# Altium project Prj_Smart_Door_Quach_Trung_An.PrjPcb
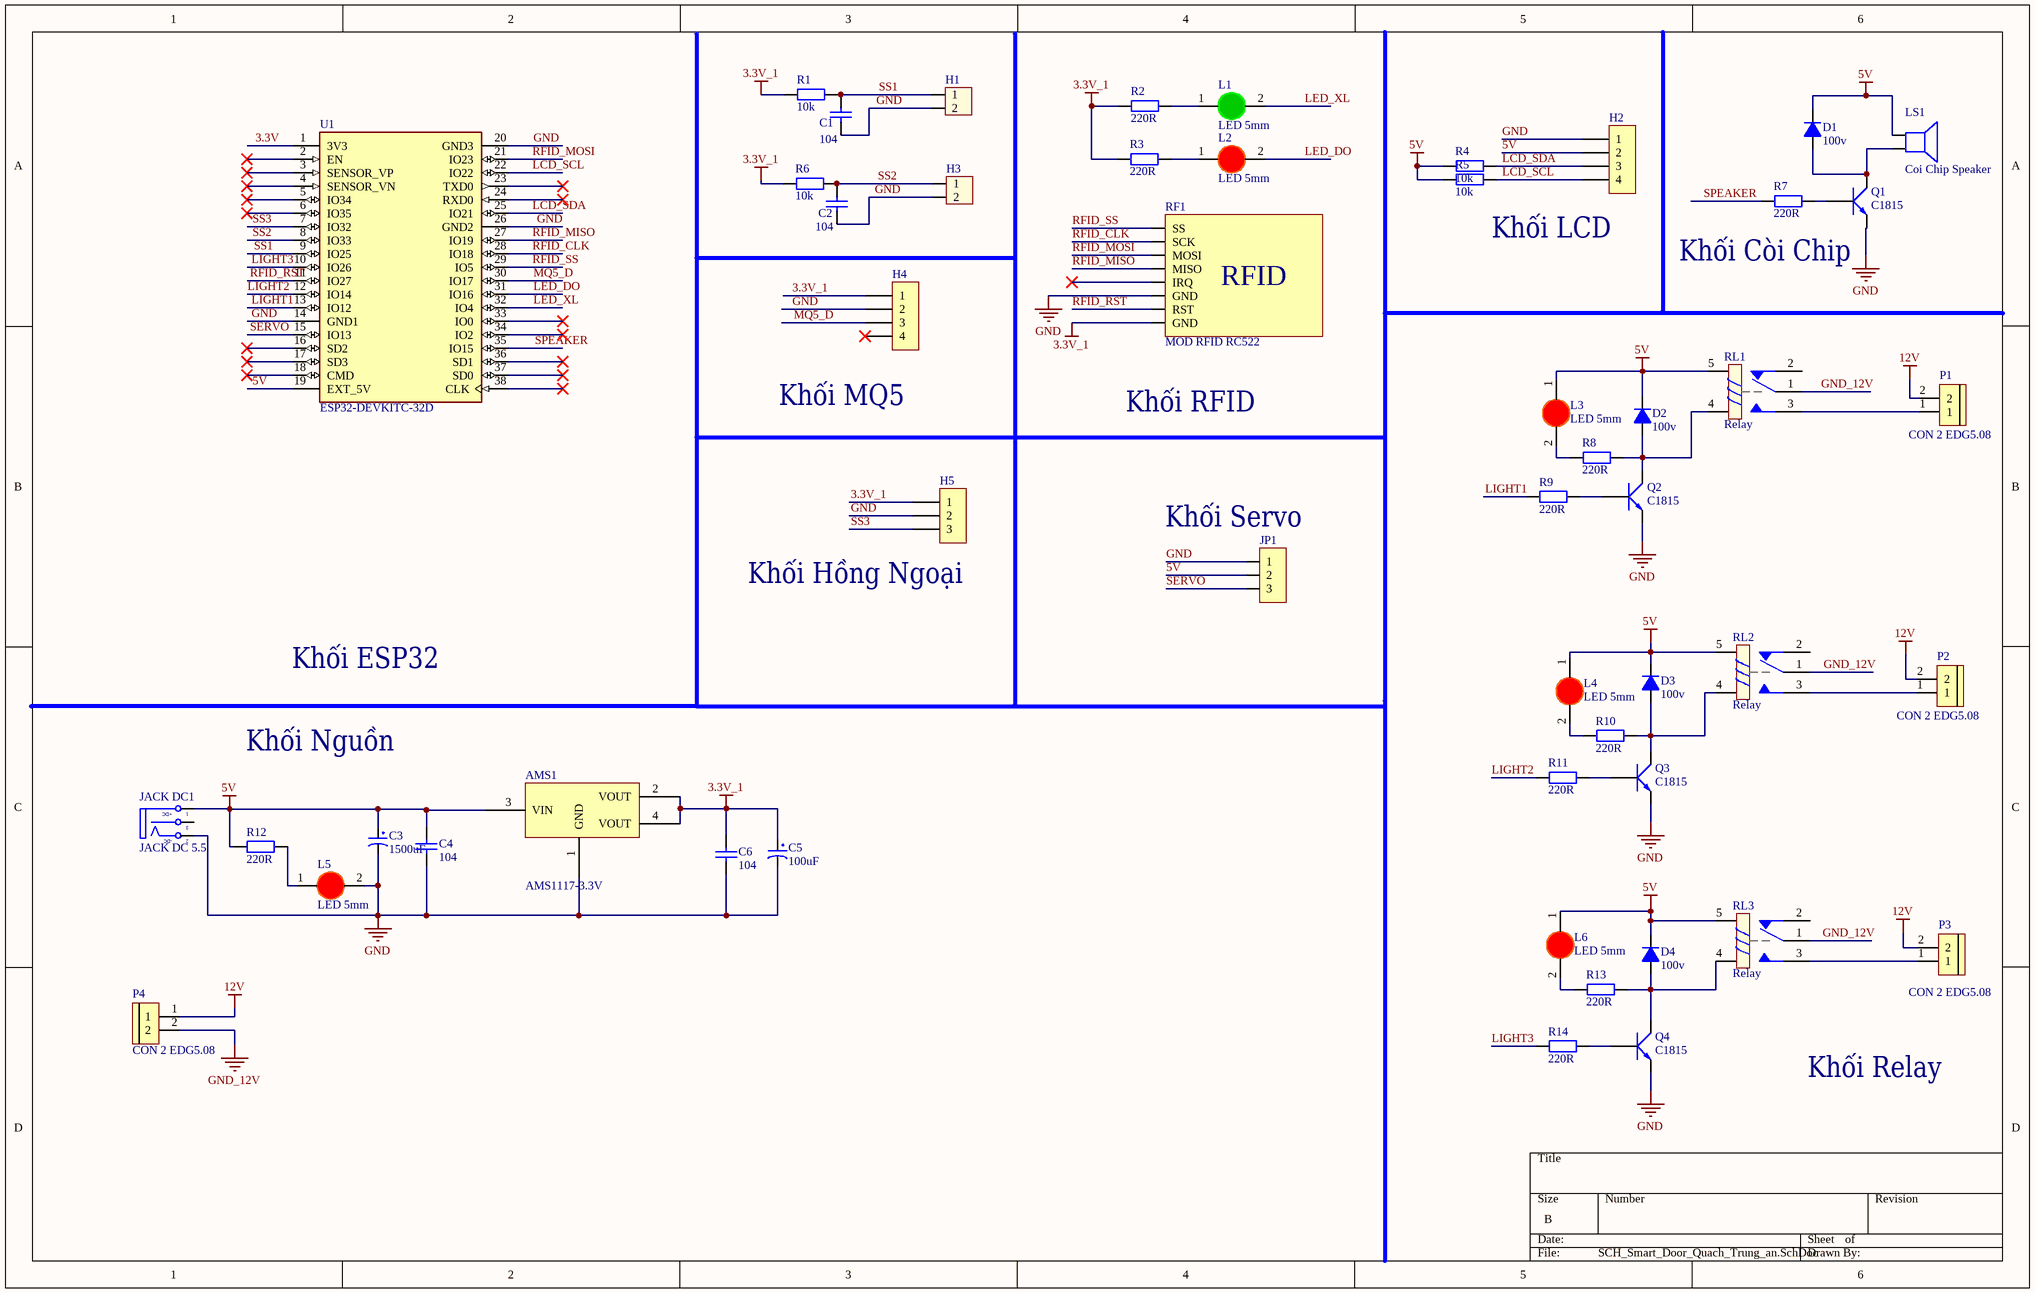
[diagram p0: SCH_Smart_Door_Quach_Trung_an.SchDoc]
1 sheet, 52 parts. Net scope: global (net labels, ports and power ports of the same name join across sheets).
Board file: PCB_Smart_Door_Quach_Trung_An.PcbDoc

## Sheet SCH_Smart_Door_Quach_Trung_an.SchDoc
size B; SheetNumber: 1; SheetTotal: 1

### Parts
AMS1  AMS1117-3.3V  [SOT223]
C1  104  [tu gom]
C2  104  [tu gom]
C3  1500uF  [tu hoa 10mm]
C4  104  [tu gom]
C5  100uF  [tu hoa 5mm]
C6  104  [tu gom]
D1  100v  [DIODE 1A]
D2  100v  [DIODE 1A]
D3  100v  [DIODE 1A]
D4  100v  [DIODE 1A]
H1  Header 2P 2.54 Duc Cong  [Header 2P DC 2.54]  (value not drawn)
H2  Header 4P 2.54 Duc Cong  [Header 4P DC 2.54]  (value not drawn)
H3  Header 2P 2.54 Duc Cong  [Header 2P DC 2.54]  (value not drawn)
H4  Header 4P 2.54 Duc Cong  [Header 4P DC 2.54]  (value not drawn)
H5  Header 3P 2.54 Duc Cong  [Header 3P DC 2.54]  (value not drawn)
JACK_DC1  JACK DC 5.5  [JACK DC 5.5]
JP1  JP 1x3 2.54  [JP 1x3 DC]  (value not drawn)
L1  LED 5mm  [LED-5MM-Green]
L2  LED 5mm  [LED-5MM-RED]
L3  LED 5mm  [LED-5MM-RED]
L4  LED 5mm  [LED-5MM-RED]
L5  LED 5mm  [LED-5MM-RED]
L6  LED 5mm  [LED-5MM-RED]
LS1  Coi Chip Speaker  [Coi Chip Speacker]
P1  CON 2 EDG5.08  [CON 2 2EDG5.08]
P2  CON 2 EDG5.08  [CON 2 2EDG5.08]
P3  CON 2 EDG5.08  [CON 2 2EDG5.08]
P4  CON 2 EDG5.08  [CON 2 2EDG5.08]
Q1  C1815  [TO92]
Q2  C1815  [TO92]
Q3  C1815  [TO92]
Q4  C1815  [TO92]
R1  10k  [tro vach 1/4w]
R2  220R  [tro vach 1/4w]
R3  220R  [tro vach 1/4w]
R4  10k  [tro vach 1/4w]
R5  10k  [tro vach 1/4w]
R6  10k  [tro vach 1/4w]
R7  220R  [tro vach 1/4w]
R8  220R  [tro vach 1/4w]
R9  220R  [tro vach 1/4w]
R10  220R  [tro vach 1/4w]
R11  220R  [tro vach 1/4w]
R12  220R  [tro vach 1/4w]
R13  220R  [tro vach 1/4w]
R14  220R  [tro vach 1/4w]
RF1  MOD RFID RC522  [MOD RFID RC522]
RL1  Relay  [Relay 5 Chan SRD]
RL2  Relay  [Relay 5 Chan SRD]
RL3  Relay  [Relay 5 Chan SRD]
U1  ESP32-DEVKITC-32D  [MODULE_ESP32-DEVKITC-32D]

### Nets
3.3V_1: AMS1.2(VOUT) AMS1.4(VOUT) C5.1 C6.1 H4.1 H5.1 R1.1 R2.1 R3.1 R6.1 RF1.8(GND)
5V: AMS1.3(VIN) C3.1 C4.1 D1.2(K) D2.2(K) D3.2(K) D4.2(K) H2.2 JACK_DC1.1(T) JP1.2 L3.1(A) L4.1(A) L6.1(A) LS1.1 R4.1 R5.1 R12.1 RL1.5 RL2.5 RL3.5 U1.19(EXT_5V)
12V: P1.2 P2.2 P3.2 P4.1
GND: AMS1.1(GND) C1.2 C2.2 C3.2 C4.2 C5.2 C6.2 H1.2 H2.1 H3.2 H4.2 H5.2 JACK_DC1.2(TN) JP1.1 L5.2(K) Q1.1(E) Q2.1(E) Q3.1(E) Q4.1(E) RF1.6(GND) U1.14(GND1) U1.20(GND3) U1.26(GND2)
GND_12V: P4.2 RL1.1 RL2.1 RL3.1
3.3V: U1.1(3V3)
LCD_SCL: H2.4 R5.2 U1.22(IO22)
LCD_SDA: H2.3 R4.2 U1.25(IO21)
LED_DO: L2.2(K) U1.31(IO16)
LED_XL: L1.2(K) U1.32(IO4)
LIGHT1: R9.1 U1.13(IO12)
LIGHT2: R11.1 U1.12(IO14)
LIGHT3: R14.1 U1.10(IO26)
MQ5_D: H4.3 U1.30(IO17)
RFID_CLK: RF1.2(SCK) U1.28(IO18)
RFID_MISO: RF1.4(MISO) U1.27(IO19)
RFID_MOSI: RF1.3(MOSI) U1.21(IO23)
RFID_RST: RF1.7(RST) U1.11(IO27)
RFID_SS: RF1.1(SS) U1.29(IO5)
SERVO: JP1.3 U1.15(IO13)
SPEAKER: R7.1 U1.35(IO15)
SS1: C1.1 H1.1 R1.2 U1.9(IO25)
SS2: C2.1 H3.1 R6.2 U1.8(IO33)
SS3: H5.3 U1.7(IO32)
NetD1_1: D1.1(A) LS1.2 Q1.2(C)
NetD2_1: D2.1(A) Q2.2(C) R8.1 RL1.4
NetD3_1: D3.1(A) Q3.2(C) R10.1 RL2.4
NetD4_1: D4.1(A) Q4.2(C) R13.1 RL3.4
NetL1_1: L1.1(A) R2.2
NetL2_1: L2.1(A) R3.2
NetL3_2: L3.2(K) R8.2
NetL4_2: L4.2(K) R10.2
NetL5_1: L5.1(A) R12.2
NetL6_2: L6.2(K) R13.2
NetP1_1: P1.1 RL1.3
NetP2_1: P2.1 RL2.3
NetP3_1: P3.1 RL3.3
NetQ1_3: Q1.3(B) R7.2
NetQ2_3: Q2.3(B) R9.2
NetQ3_3: Q3.3(B) R11.2
NetQ4_3: Q4.3(B) R14.2

Not connected (* = marked no-connect by the designer): H4 4*; JACK_DC1 3(S); RF1 5(IRQ)*; RL1 2; RL2 2; RL3 2; U1 2(EN)* 3(SENSOR_VP)* 4(SENSOR_VN)* 5(IO34)* 6(IO35)* 16(SD2)* 17(SD3)* 18(CMD)* 23(TXD0)* 24(RXD0)* 33(IO0)* 34(IO2)* 36(SD1)* 37(SD0)* 38(CLK)*

### Notes on the sheet
- Khối LCD
- Khối Còi Chip
- (near H4) Khối MQ5
- Khối RFID
- (near JP1) Khối Servo
- (near H5) Khối Hồng Ngoại
- Khối ESP32
- Khối Nguồn
- Khối Relay
- (in symbol JACK DC 5.5) +DC; -DC
- (in symbol MOD RFID RC522) RFID

### Library data of the parts
AMS1 = AMS1117 SMD: Dán; Value: AMS1117-3.3V SOT223; Don_Vi: Con; Ma_Hang: MH000596; Ghi_Chu: *; Kieu_Chan: *; Chung_Loai: Dán
C1 C2 C4 C6 = Tu gom 104 50V: Cắm; So_Chan: 2; Ten_Linh_Kien: Tụ gốm 104 100nF 50V; Don_Vi: Con; Ma_Hang: MH004761; Chung_Loai: Cắm; Kieu_Chan: *
C3 = Tu Hoa 1500uF 16V 10x20: Cắm; Don_Vi: Con; So_Chan: 2; Ten_Linh_Kien: Tụ Hóa 1500uF 16V 10x20MM; Ma_Hang: MH006603; Chung_Loai: Cắm; Kieu_Chan: *
C5 = Tu Hoa 100uF 16V 5x7: Cắm; Don_Vi: Con; So_Chan: 2; Ten_Linh_Kien: Tụ Hóa 100uF 16V 5x7MM; Ma_Hang: MH001347; Chung_Loai: Cắm; Kieu_Chan: *
D1-D4 = Diode 1N4007: Cắm; Ten_Linh_Kien: Diode 1N4007 1A (DIP); Don_Vi: Con; Ma_Hang: MH001063; Ghi Chu: *; Kieu_Chan: *; Chung_Loai: Cắm
H1 H3 = Header 2P 2.54 Duc Cong: Cắm; Ten_Linh_Kien: Header 2P XH2.54-2P Đực Cong; Don_Vi: Con; Ma_Hang: MH002852; Chung_Loai: Cắm
H2 H4 = Header 4P 2.54 Duc Cong: Cắm; Ten_Linh_Kien: Header 4P XH2.54-4P Đực Cong; Don_Vi: Con; Ma_Hang: MH001310; Chung_Loai: Cắm
H5 = Header 3P 2.54 Duc Cong: Cắm; Ten_Linh_Kien: Header 3P XH2.54-3P Đực Cong; Don_Vi: Con; Ma_Hang: MH001302; Chung_Loai: Cắm
JACK_DC1 = JACK DC 5.5: Value: Jac DC
JP1 = JP 1x3 2.54 Duc Cong: Cắm; Ten_Linh_Kien: Jump Đơn Đực 2.54MM 1x40P Cong Đứng; Don_Vi: Con; Ma_Hang: MH000904; Ghi_Chu: *; Kieu_Chan: *; Chung_Loai: Cắm
L1 = LED 5mm Xanh La: Cắm; Don_Vi: Con; Ma_Hang: MH008969; Ten_Linh_Kien: LED 5MM Phủ Xanh (1000c); Ghi_Chu: *; Kieu_Chan: *; Chung_Loai: Cắm
L2-L6 = LED 5mm Do: Cắm; Don_Vi: Con; Ma_Hang: MH008967; Ten_Linh_Kien: Led 5MM Phủ Đỏ (1000c); Ghi_Chu: *; Kieu_Chan: *; Chung_Loai: Cắm
LS1 = Coi Chip Speaker: Còi chip
P1-P4 = CON 2 EDG5.08: Cắm; Ten_Linh_Kien: CON 2 2EDG5.08-2P 5.08MM ( Xanh Cong); Ma_Hang: MH000759; Ghi_Chu: *; Don_Vi: Con; Kieu_Chan: *; Chung_Loai: Cắm
Q1-Q4 = C1815: NPN transistor; Value: C9014
R1 R4-R6 = Tro Vach 1/4W 5% 10k: Căm; Chung_Loai: Cắm; Don_Vi: Con; So_Chan: 2; Ten_Linh_Kien: Trở Vạch 1/4w 5% 10K; Ma_Hang: MH007354; Kieu_Chan: *
R2 R3 R7-R14 = Tro Vach 1/4W 5% 220R: Cắm; Don_Vi: Con; So_Chan: 2; Ten_Linh_Kien: Trở Vạch 1/4w 5% 220R; Ma_Hang: MH007300; Chung_Loai: Cắm; Kieu_Chan: *
RL1-RL3 = Relay 5 Chan SRD: Relay 5 Chan; Ma_Hang: MH009374; Ten: Relay 5V10A SRD-05VDC-SL-C Chính Hãng
U1 = ESP32-DEVKITC-32D: EVAL BOARD FOR ESP-WROOM-32; MF: Espressif Systems; Value: *; MP: ESP32-DEVKITC-32D; Price: None; Check_prices: https://www.snapeda.com/parts/ESP32-DEVKITC-32D/Espressif%20Systems/view-part/2777395/?ref=eda; SnapEDA_Link: https://www.snapeda.com/parts/ESP32-DEVKITC-32D/Espressif%20Systems/view-part/2777395/?ref=snap; Availability: Warning; Purchase-URL: https://pricing.snapeda.com/search/part/ESP32-DEVKITC-32D/?ref=eda; Package: None